# Altium schematic sheet 01.SYS_POWER.SchDoc
size 297 x 209 mm
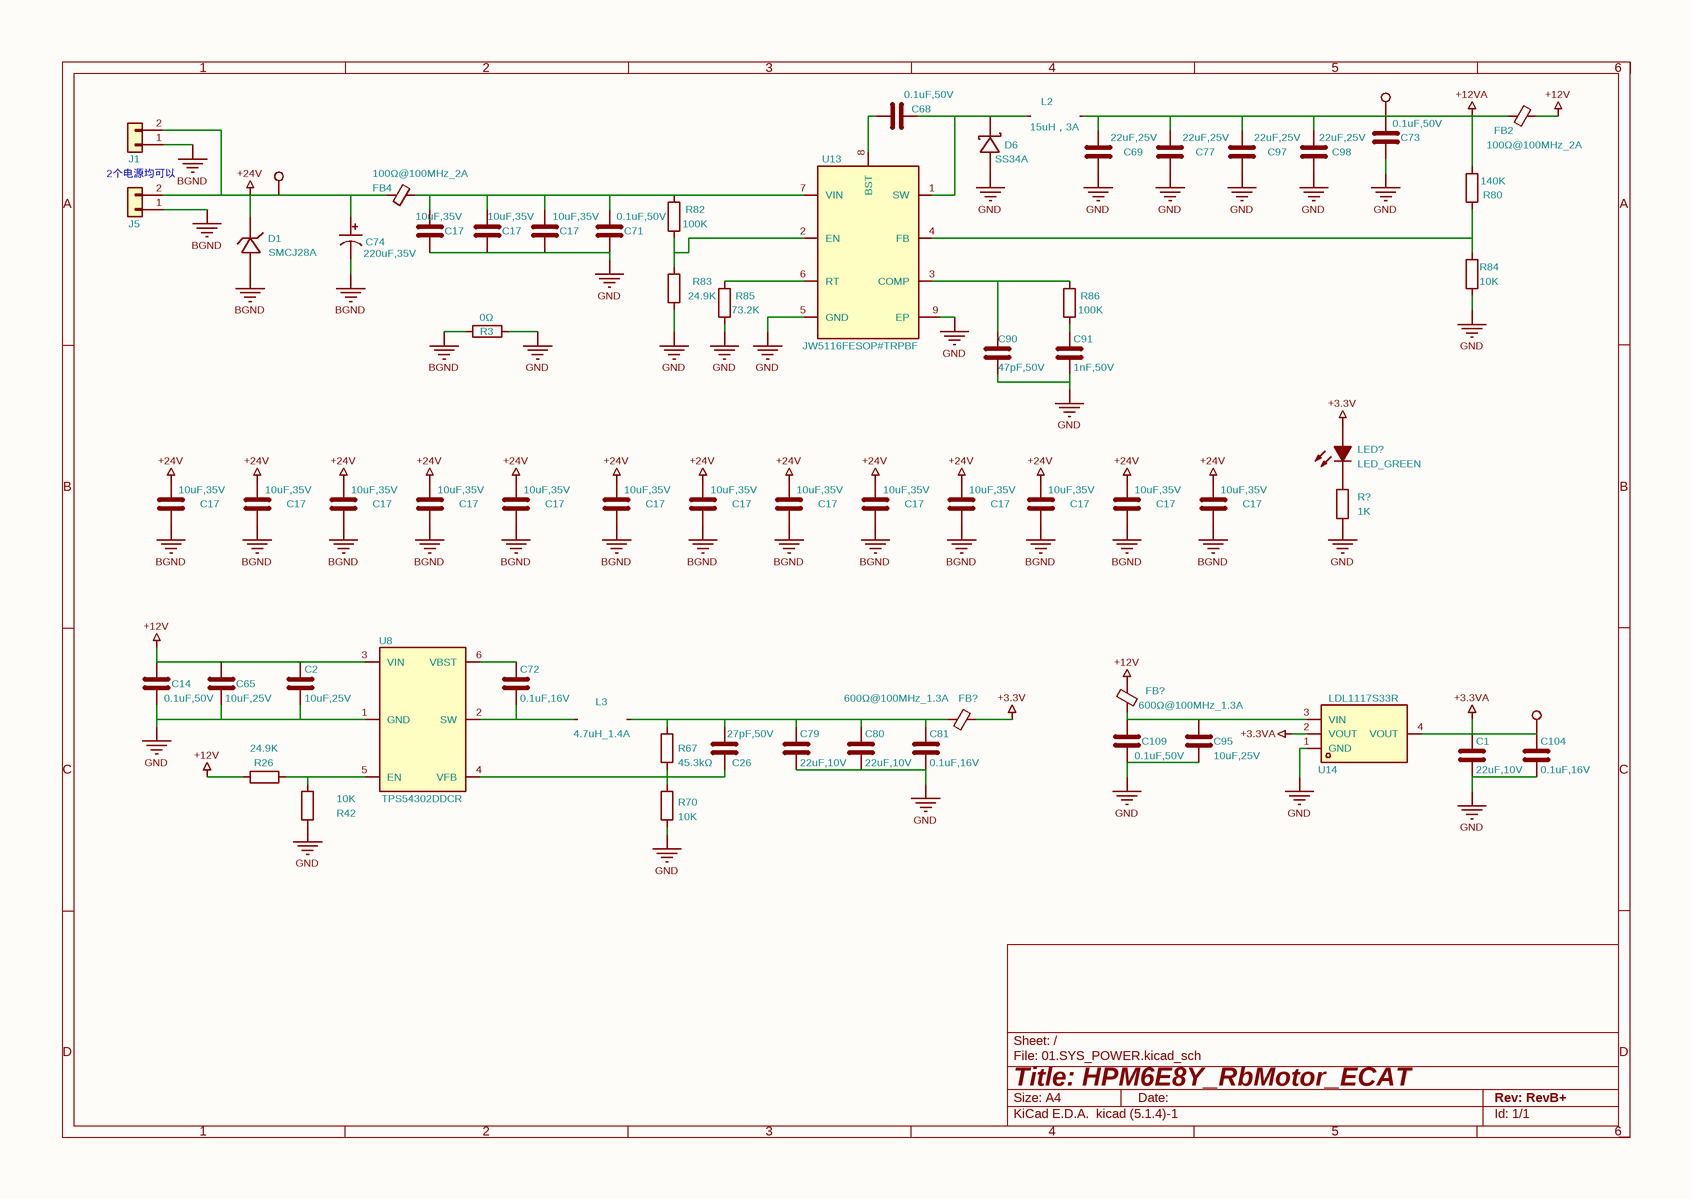
[diagram p0: 01.SYS_POWER.SchDoc]

## Parts
(Parts that share a designator on the sheet are numbered #1, #2 ... from top to bottom, then left to right.)
C1  22uF,10V  [C_0603_1608Metric]
C2  10uF,25V  [C_0603_1608Metric]
C14  0.1uF,50V  [C_0603_1608Metric]
C17#1  10uF,35V  [C_0603_1608Metric]
C17#2  10uF,35V  [C_0603_1608Metric]
C17#3  10uF,35V  [C_0603_1608Metric]
C17#4  10uF,35V  [C_0805_2012Metric]
C17#5  10uF,35V  [C_0805_2012Metric]
C17#6  10uF,35V  [C_0805_2012Metric]
C17#7  10uF,35V  [C_0805_2012Metric]
C17#8  10uF,35V  [C_0805_2012Metric]
C17#9  10uF,35V  [C_0805_2012Metric]
C17#10  10uF,35V  [C_0805_2012Metric]
C17#11  10uF,35V  [C_0805_2012Metric]
C17#12  10uF,35V  [C_0805_2012Metric]
C17#13  10uF,35V  [C_0805_2012Metric]
C17#14  10uF,35V  [C_0805_2012Metric]
C17#15  10uF,35V  [C_0805_2012Metric]
C17#16  10uF,35V  [C_0805_2012Metric]
C26  27pF,50V  [C_0402]
C65  10uF,25V  [C_0603_1608Metric]
C68  0.1uF,50V  [C_0402_1005Metric]
C69  22uF,25V  [C_0805_2012Metric]
C71  0.1uF,50V  [C_0402_1005Metric]
C72  0.1uF,16V  [C_0402]
C73  0.1uF,50V  [C_0402_1005Metric]
C74  220uF,35V  [CAP-SMD_BD8.0-L8.3-W8.3-LS9.1-FD]
C77  22uF,25V  [C_0805_2012Metric]
C79  22uF,10V  [C_0603_1608Metric]
C80  22uF,10V  [C_0603_1608Metric]
C81  0.1uF,16V  [C_0402]
C90  47pF,50V  [C_0402_1005Metric]
C91  1nF,50V  [C_0402_1005Metric]
C95  10uF,25V  [C_0603_1608Metric]
C97  22uF,25V  [C_0805_2012Metric]
C98  22uF,25V  [C_0805_2012Metric]
C104  0.1uF,16V  [C_0402]
C109  0.1uF,50V  [C_0603_1608Metric]
D1  SMCJ28A  [D_SMC]
D6  SS34A  [D_SMA]
FB2  100Ω@100MHz_2A  [R_0805_2012Metric]
FB4  100Ω@100MHz_2A  [R_0603_1608Metric]
FB?#1  600Ω@100MHz_1.3A  [R_0603_1608Metric]
FB?#2  600Ω@100MHz_1.3A  [R_0603_1608Metric]
J1  Conn_01x02  [XT30U 母头插座]  (value not drawn)
J5  Conn_01x02  [XT30U 母头插座]  (value not drawn)
L2  15uH，3A  [IND-SMD_L7.0-W6.6_FXL0630]
L3  4.7uH_1.4A  [L252010]
LED?  LED_GREEN  [LED_0603]
R3  0Ω  [R_0805_2012Metric]
R26  24.9K  [R_0402_1005Metric]
R42  10K  [R_0402_1005Metric]
R67  45.3kΩ  [R_0402_1005Metric]
R70  10K  [R_0402_1005Metric]
R80  140K  [R_0402_1005Metric]
R82  100K  [C_0402_1005Metric]
R83  24.9K  [C_0402_1005Metric]
R84  10K  [R_0402_1005Metric]
R85  73.2K  [C_0402_1005Metric]
R86  100K  [C_0402_1005Metric]
R?  1K  [R_0402_1005Metric]
TP1  0.5mm  [TestPoint_Pad_D0.5mm]  (value not drawn)
TP36  0.5mm  [TestPoint_Pad_D0.5mm]  (value not drawn)
TP40  0.5mm  [TestPoint_Pad_D0.5mm]  (value not drawn)
U8  TPS54302DDCR  [SOT-23-6]
U13  JW5116FESOP#TRPBF  [SOIC-8EP]
U14  LDL1117S33R  [SOT-223-4_L6.5-W3.5-P2.30-LS7.0-BR]

## Nets
+3.3V: FB?#2.1 LED?.2(A)
+3.3VA: C1.1 C104.1 TP36.1 U14.2(VOUT) U14.4(VOUT)
+12V: C2.1 C14.1 C65.1 FB2.1 FB?#1.1 R26.2 U8.3(VIN)
+12VA: C69.1 C73.2 C77.1 C97.1 C98.1 FB2.2 L2.2 R80.2 TP1.1
+24V: C17#4.1 C17#5.1 C17#6.1 C17#7.1 C17#8.1 C17#9.1 C17#10.1 C17#11.1 C17#12.1 C17#13.1 C17#14.1 C17#15.1 C17#16.1 C74.1 D1.1(C) FB4.2 J1.2(Pin_2) J5.2(Pin_2) TP40.1
BGND: C17#4.2 C17#5.2 C17#6.2 C17#7.2 C17#8.2 C17#9.2 C17#10.2 C17#11.2 C17#12.2 C17#13.2 C17#14.2 C17#15.2 C17#16.2 C74.2 D1.2(A) J1.1(Pin_1) J5.1(Pin_1) R3.1
GND: C1.2 C2.2 C14.2 C17#1.2 C17#2.2 C17#3.2 C65.2 C69.2 C71.1 C73.1 C77.2 C79.2 C80.2 C81.2 C90.2 C91.2 C95.2 C97.2 C98.2 C104.2 C109.2 D6.2(A) R3.2 R42.2 R70.1 R83.1 R84.1 R85.1 R?.1 U8.1(GND) U13.5(GND) U13.9(EP) U14.1(GND)
NetC17#1_1: C17#1.1 C17#2.1 C17#3.1 C71.2 FB4.1 R82.2 U13.7(VIN)
NetC26_1: C26.1 R67.1 R70.2 U8.4(VFB)
NetC26_2: C26.2 C79.1 C80.1 C81.1 FB?#2.2 L3.2 R67.2
NetC68_1: C68.1 U13.8(BST)
NetC68_2: C68.2 D6.1(K) L2.1 U13.1(SW)
NetC72_1: C72.1 U8.6(VBST)
NetC72_2: C72.2 L3.1 U8.2(SW)
NetC90_1: C90.1 R86.2 U13.3(COMP)
NetC91_1: C91.1 R86.1
NetC95_1: C95.1 C109.1 FB?#1.2 U14.3(VIN)
NetLED?_1: LED?.1(K) R?.2
NetR26_1: R26.1 R42.1 U8.5(EN)
NetR80_1: R80.1 R84.2 U13.4(FB)
NetR82_1: R82.1 R83.2 U13.2(EN)
NetR85_2: R85.2 U13.6(RT)

## Notes on the sheet
- 2个电源均可以
- 1
- 2
- 3
- 4
- 5
- 6
- A
- B
- C
- D
- Title: HPM6E8Y_RbMotor_ECAT
- File: 01.SYS_POWER.kicad_sch
- Sheet: /
- KiCad E.D.A.  kicad (5.1.4)-1
- Size: A4
- Date:
- Rev: RevB+
- Id: 1/1

## Library data of the parts
C1 C79 C80 = 22uF,10V_0603: Model: CL10A226MP8NUNE; Company: SAMSUNG(三星); Value: 22uF,10V; Footprint: 03_HPM_Capacitance:C_0603_1608Metric
C2 C65 C95 = 10uF,16V_0603: Model: CL10A106MA8NRNC; Company: SAMSUNG(三星); Value: 10uF,25V; Footprint: 03_HPM_Capacitance:C_0603_1608Metric
C14 C68 C109 = 0.1uF,50V,0603: Model: CC0603JRX7R9BB104; Company: YAGEO; Value: 0.1uF,50V
  C14 C109: Footprint: 03_HPM_Capacitance:C_0603_1608Metric
  C68: Footprint: 03_HPM_Capacitance:C_0402_1005Metric
C17#1-C17#3 = 10uF,35V_0805: Company: muRata(村田); Value: 10uF,35V; Footprint: 03_HPM_Capacitance:C_0603_1608Metric
C17#4-C17#16 = 10uF,35V_0805: Model: GRM21BR6YA106KE43L; Company: muRata(村田); Value: 10uF,35V; Footprint: 03_HPM_Capacitance:C_0805_2012Metric
C26 = 27pF,50V_0402: Model: 0402CG270J500NT; Company: FH(风华); Value: 27pF,50V; Footprint: 03_HPM_Capacitance:C_0402
C69 C77 C97 C98 = 22uF,25V_0805: Model: CL21A226MAQNNNE; Company: SAMSUNG(三星); Value: 22uF,25V; Footprint: 03_HPM_Capacitance:C_0805_2012Metric
C71 C73 = 0.1uF,50V,0603: Company: YAGEO; Value: 0.1uF,50V; Footprint: 03_HPM_Capacitance:C_0402_1005Metric
C72 C81 C104 = 0.1uF,16V: Model: CL05B104KO5NNNC; Company: SAMSUNG(三星); Value: 0.1uF,16V; Footprint: 03_HPM_Capacitance:C_0402
C74 = 固态电容 _220uF,35V_SMD: Model: JBLM2221M035D090RTM; Company: DMBJ(振宝佳); Value: 220uF,35V; Footprint: 03_HPM_Capacitance:CAP-SMD_BD8.0-L8.3-W8.3-LS9.1-FD
C90 = 47pF,50V_0402: Model: CC0402JRNPO9BN470; Company: YAGEO(国巨); Value: 47pF,50V; Footprint: 03_HPM_Capacitance:C_0402_1005Metric
C91 = 1nF,50V,0603: Model: CC0603JRX7R9BB102; Company: YAGEO; Value: 1nF,50V; Footprint: 03_HPM_Capacitance:C_0402_1005Metric
D1 = SMCJ28A: Company: Littelfuse(美国力特); Model: SMCJ28A; Value: SMCJ28A; Footprint: 04_HPM_Diode:D_SMC
D6 = SS34A: Company: YANGJIE(扬杰); Model: SS34A; Value: SS34A; Footprint: 04_HPM_Diode:D_SMA
FB2 = 磁珠-100Ω@100MHz_2A_0805: Model: PZ2012U101-2R0TF; Company: Sunlord(顺络); Value: 100Ω@100MHz_2A; Footprint: 02_HPM_Resistor:R_0805_2012Metric
FB4 = 磁珠-100Ω@100MHz_2A_0603: Model: PZ1608D101-2R0TF; Company: Sunlord(顺络); Value: 100Ω@100MHz_2A; Footprint: 02_HPM_Resistor:R_0603_1608Metric
FB?#1 FB?#2 = 磁珠-600Ω@100MHz_1.3A_0603: Model: BLM18KG601SN1D; Company: muRata(村田); Value: 600Ω@100MHz_1.3A; Footprint: 02_HPM_Resistor:R_0603_1608Metric
J1 J5 = Conn_01x02: Model: XT30UPB-M 公头 PCB焊板; Value: Conn_01x02; Footprint: 13_ower:XT30U 母头插座
L2 = 15uH，3A: Model: FXL0630-150-M; Company: cjiang(长江微电); Value: 15uH，3A; Footprint: 07_HPM_Inductance:IND-SMD_L7.0-W6.6_FXL0630
L3 = 4.7uH_1.4A: Model: DFE252010F-4R7M; Company: muRata(村田); Value: 4.7uH_1.4A; Footprint: 07_HPM_Inductance:L252010
LED? = LED_GREEN: Model: NCD0603C1; Company: 国星光电; Value: LED_GREEN; Footprint: 01_HPM_Peripheral:LED_0603
R3 = 0Ω_0805: Model: RS-05000JT; Company: FH(风华); Value: 0Ω; Footprint: 02_HPM_Resistor:R_0805_2012Metric
R26 = 24.9K_0603: Company: UNI-ROYAL(厚声); Value: 24.9K; Footprint: 02_HPM_Resistor:R_0402_1005Metric
R42 R70 = 10K: Model: 0402WGF1002TCE; Company: UNI-ROYAL(厚声); Value: 10K; Footprint: 02_HPM_Resistor:R_0402_1005Metric
R67 = 100K: Model: 0402WGF4532TCE; Company: UNI-ROYAL(厚声); Value: 45.3kΩ; Footprint: 02_HPM_Resistor:R_0402_1005Metric
R80 = 140K_0402: Model: 0402WGF1403TCE; Company: UNI-ROYAL(厚声); Value: 140K; Footprint: 02_HPM_Resistor:R_0402_1005Metric
R82 = 100K: Model: 0603WAF1003T5E; Company: UNI-ROYAL(厚声); Value: 100K; Footprint: 03_HPM_Capacitance:C_0402_1005Metric
R83 = 24.9K_0603: Model: 0603WAF2492T5E; Company: UNI-ROYAL(厚声); Value: 24.9K; Footprint: 03_HPM_Capacitance:C_0402_1005Metric
R84 = 10K_0402: Model: 0402WGF1002TCE; Company: UNI-ROYAL(厚声); Value: 10K; Footprint: 02_HPM_Resistor:R_0402_1005Metric
R85 = 100K: Model: 0402WGF7322TCE; Company: UNI-ROYAL(厚声); Value: 73.2K; Footprint: 03_HPM_Capacitance:C_0402_1005Metric
R86 = 100K: Model: 0402WGF1003TCE; Company: UNI-ROYAL(厚声); Value: 100K; Footprint: 03_HPM_Capacitance:C_0402_1005Metric
R? = 1K_0402: Model: 0402WGF1001TCE; Company: UNI-ROYAL(厚声); Value: 1K; Footprint: 02_HPM_Resistor:R_0402_1005Metric
TP1 TP36 TP40 = TestPoint-0.5mm: Value: 0.5mm; Footprint: 01_HPM_Peripheral:TestPoint_Pad_D0.5mm
U8 = TPS564201DDCR: Company: TI; Model: TPS54302DDCR; Value: TPS54302DDCR; Footprint: 06_HPM_SOT:SOT-23-6
U13 = JW5116FESOP#TRPBF: Company: Joulwatt(杰华特); Model: JW5116FESOP#TRPBF; Value: JW5116FESOP#TRPBF; Footprint: 06_HPM_SO:SOIC-8EP
U14 = LDL1117S33R: Company: ST(意法半导体); Model: LDL1117S33R; Value: LDL1117S33R; Footprint: 06_HPM_SOT:SOT-223-4_L6.5-W3.5-P2.30-LS7.0-BR